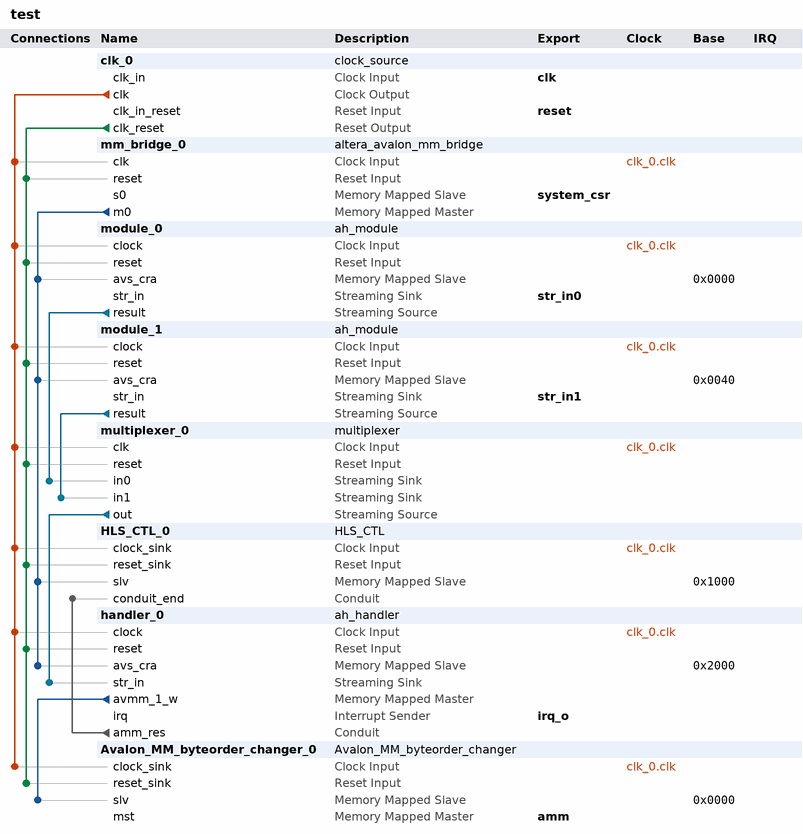
[diagram p0: system contents]
# Platform Designer (Qsys) system test, Cyclone V 5CSEMA4U23C6
# Parameters at their usual value, and those the tool derives, are not listed.
package require -exact qsys 17.1
create_system test
set_project_property DEVICE_FAMILY {Cyclone V}
set_project_property DEVICE 5CSEMA4U23C6

add_instance clk_0 clock_source 17.1
set_instance_parameter_value clk_0 clockFrequency 50000000

add_instance mm_bridge_0 altera_avalon_mm_bridge 17.1
set_instance_parameter_value mm_bridge_0 ADDRESS_UNITS SYMBOLS
set_instance_parameter_value mm_bridge_0 ADDRESS_WIDTH 10
set_instance_parameter_value mm_bridge_0 DATA_WIDTH 64
set_instance_parameter_value mm_bridge_0 MAX_PENDING_RESPONSES 4
set_instance_parameter_value mm_bridge_0 USE_AUTO_ADDRESS_WIDTH 1

add_instance module_0 ah_module 1.0

add_instance module_1 ah_module 1.0

add_instance multiplexer_0 multiplexer 17.1
set_instance_parameter_value multiplexer_0 bitsPerSymbol 64
set_instance_parameter_value multiplexer_0 errorWidth 0
set_instance_parameter_value multiplexer_0 numInputInterfaces 2
set_instance_parameter_value multiplexer_0 outChannelWidth 1
set_instance_parameter_value multiplexer_0 packetScheduling false
set_instance_parameter_value multiplexer_0 schedulingSize 2
set_instance_parameter_value multiplexer_0 symbolsPerBeat 1
set_instance_parameter_value multiplexer_0 useHighBitsOfChannel false
set_instance_parameter_value multiplexer_0 usePackets false

add_instance HLS_CTL_0 HLS_CTL 1.0

add_instance handler_0 ah_handler 1.0

add_instance Avalon_MM_byteorder_changer_0 Avalon_MM_byteorder_changer 1.0
set_instance_parameter_value Avalon_MM_byteorder_changer_0 ADDR_WIDTH 32
set_instance_parameter_value Avalon_MM_byteorder_changer_0 BURST_WIDTH 8
set_instance_parameter_value Avalon_MM_byteorder_changer_0 DATA_WIDTH 64

# connections
add_connection clk_0.clk Avalon_MM_byteorder_changer_0.clock_sink clock
add_connection clk_0.clk handler_0.clock clock
add_connection clk_0.clk HLS_CTL_0.clock_sink clock
add_connection clk_0.clk mm_bridge_0.clk clock
add_connection clk_0.clk module_0.clock clock
add_connection clk_0.clk module_1.clock clock
add_connection clk_0.clk multiplexer_0.clk clock
add_connection clk_0.clk_reset Avalon_MM_byteorder_changer_0.reset_sink reset
add_connection clk_0.clk_reset handler_0.reset reset
add_connection clk_0.clk_reset HLS_CTL_0.reset_sink reset
add_connection clk_0.clk_reset mm_bridge_0.reset reset
add_connection clk_0.clk_reset module_0.reset reset
add_connection clk_0.clk_reset module_1.reset reset
add_connection clk_0.clk_reset multiplexer_0.reset reset
add_connection handler_0.avmm_1_w Avalon_MM_byteorder_changer_0.slv avalon
set_connection_parameter_value handler_0.avmm_1_w/Avalon_MM_byteorder_changer_0.slv baseAddress 0x0000
add_connection mm_bridge_0.m0 handler_0.avs_cra avalon
set_connection_parameter_value mm_bridge_0.m0/handler_0.avs_cra baseAddress 0x2000
add_connection mm_bridge_0.m0 HLS_CTL_0.slv avalon
set_connection_parameter_value mm_bridge_0.m0/HLS_CTL_0.slv baseAddress 0x1000
add_connection mm_bridge_0.m0 module_0.avs_cra avalon
set_connection_parameter_value mm_bridge_0.m0/module_0.avs_cra baseAddress 0x0000
add_connection mm_bridge_0.m0 module_1.avs_cra avalon
set_connection_parameter_value mm_bridge_0.m0/module_1.avs_cra baseAddress 0x0040
add_connection module_0.result multiplexer_0.in0 avalon_streaming
add_connection module_1.result multiplexer_0.in1 avalon_streaming
add_connection multiplexer_0.out handler_0.str_in avalon_streaming
add_connection handler_0.amm_res HLS_CTL_0.conduit_end conduit

# exported interfaces
add_interface amm avalon master
set_interface_property amm EXPORT_OF Avalon_MM_byteorder_changer_0.mst
add_interface clk clock sink
set_interface_property clk EXPORT_OF clk_0.clk_in
add_interface irq_o interrupt sender
set_interface_property irq_o EXPORT_OF handler_0.irq
add_interface reset reset sink
set_interface_property reset EXPORT_OF clk_0.clk_in_reset
add_interface str_in0 avalon_streaming sink
set_interface_property str_in0 EXPORT_OF module_0.str_in
add_interface str_in1 avalon_streaming sink
set_interface_property str_in1 EXPORT_OF module_1.str_in
add_interface system_csr avalon slave
set_interface_property system_csr EXPORT_OF mm_bridge_0.s0

set_interconnect_requirement {$system} qsys_mm.clockCrossingAdapter HANDSHAKE
set_interconnect_requirement {$system} qsys_mm.enableEccProtection FALSE
set_interconnect_requirement {$system} qsys_mm.insertDefaultSlave FALSE
set_interconnect_requirement {$system} qsys_mm.maxAdditionalLatency 1

save_system test.qsys
